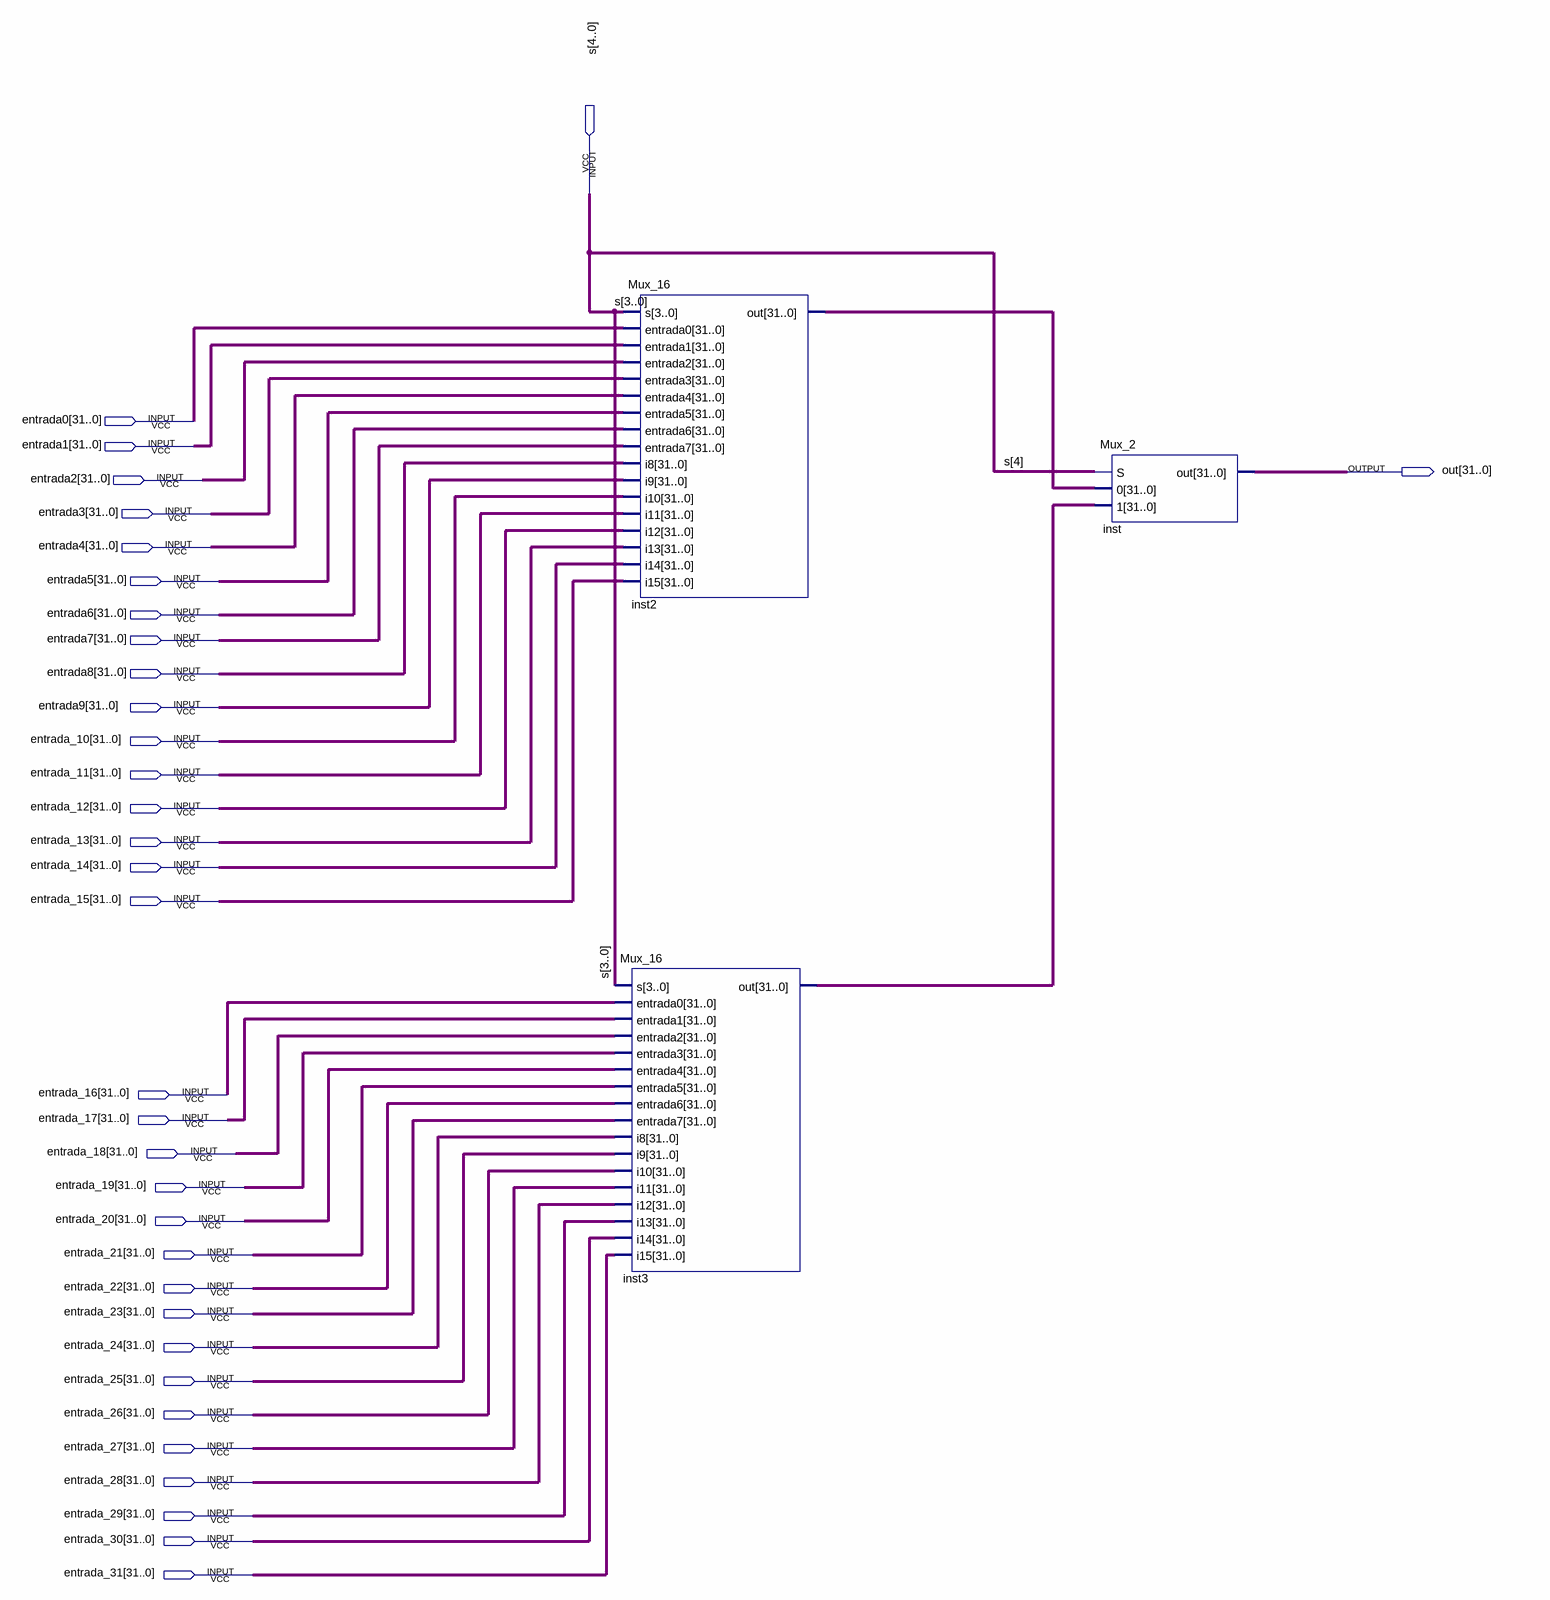
[diagram p0: schematic sheet]
// Quartus schematic Mux_32.bdf as structural Verilog: 3 symbols, 34 pins
module Mux_32 (
  input  [4:0] s,
  input  [31:0] entrada0,
  input  [31:0] entrada1,
  input  [31:0] entrada2,
  input  [31:0] entrada3,
  input  [31:0] entrada4,
  input  [31:0] entrada5,
  input  [31:0] entrada6,
  input  [31:0] entrada7,
  input  [31:0] entrada8,
  input  [31:0] entrada9,
  input  [31:0] entrada_10,
  input  [31:0] entrada_11,
  input  [31:0] entrada_12,
  input  [31:0] entrada_13,
  input  [31:0] entrada_14,
  input  [31:0] entrada_15,
  input  [31:0] entrada_16,
  input  [31:0] entrada_17,
  input  [31:0] entrada_18,
  input  [31:0] entrada_19,
  input  [31:0] entrada_20,
  input  [31:0] entrada_21,
  input  [31:0] entrada_22,
  input  [31:0] entrada_23,
  input  [31:0] entrada_24,
  input  [31:0] entrada_25,
  input  [31:0] entrada_26,
  input  [31:0] entrada_27,
  input  [31:0] entrada_28,
  input  [31:0] entrada_29,
  input  [31:0] entrada_30,
  input  [31:0] entrada_31,
  output [31:0] out
);

  wire [31:0] inst2_out, inst3_out;

  Mux_16 inst2 (
    .s(s[3:0]), .entrada0(entrada0), .entrada1(entrada1), .entrada2(entrada2), .entrada3(entrada3),
    .entrada4(entrada4), .entrada5(entrada5), .entrada6(entrada6), .entrada7(entrada7), .i8(entrada8),
    .i9(entrada9), .i10(entrada_10), .i11(entrada_11), .i12(entrada_12), .i13(entrada_13), .i14(entrada_14),
    .i15(entrada_15), .out(inst2_out));
  Mux_16 inst3 (
    .s(s[3:0]), .entrada0(entrada_16), .entrada1(entrada_17), .entrada2(entrada_18), .entrada3(entrada_19),
    .entrada4(entrada_20), .entrada5(entrada_21), .entrada6(entrada_22), .entrada7(entrada_23),
    .i8(entrada_24), .i9(entrada_25), .i10(entrada_26), .i11(entrada_27), .i12(entrada_28), .i13(entrada_29),
    .i14(entrada_30), .i15(entrada_31), .out(inst3_out));
  Mux_2 inst (.S(s[4]), .\0 (inst2_out), .\1 (inst3_out), .out(out));
endmodule
